# EAGLE design DyIO_Rev12_va (EAGLE 5.11)
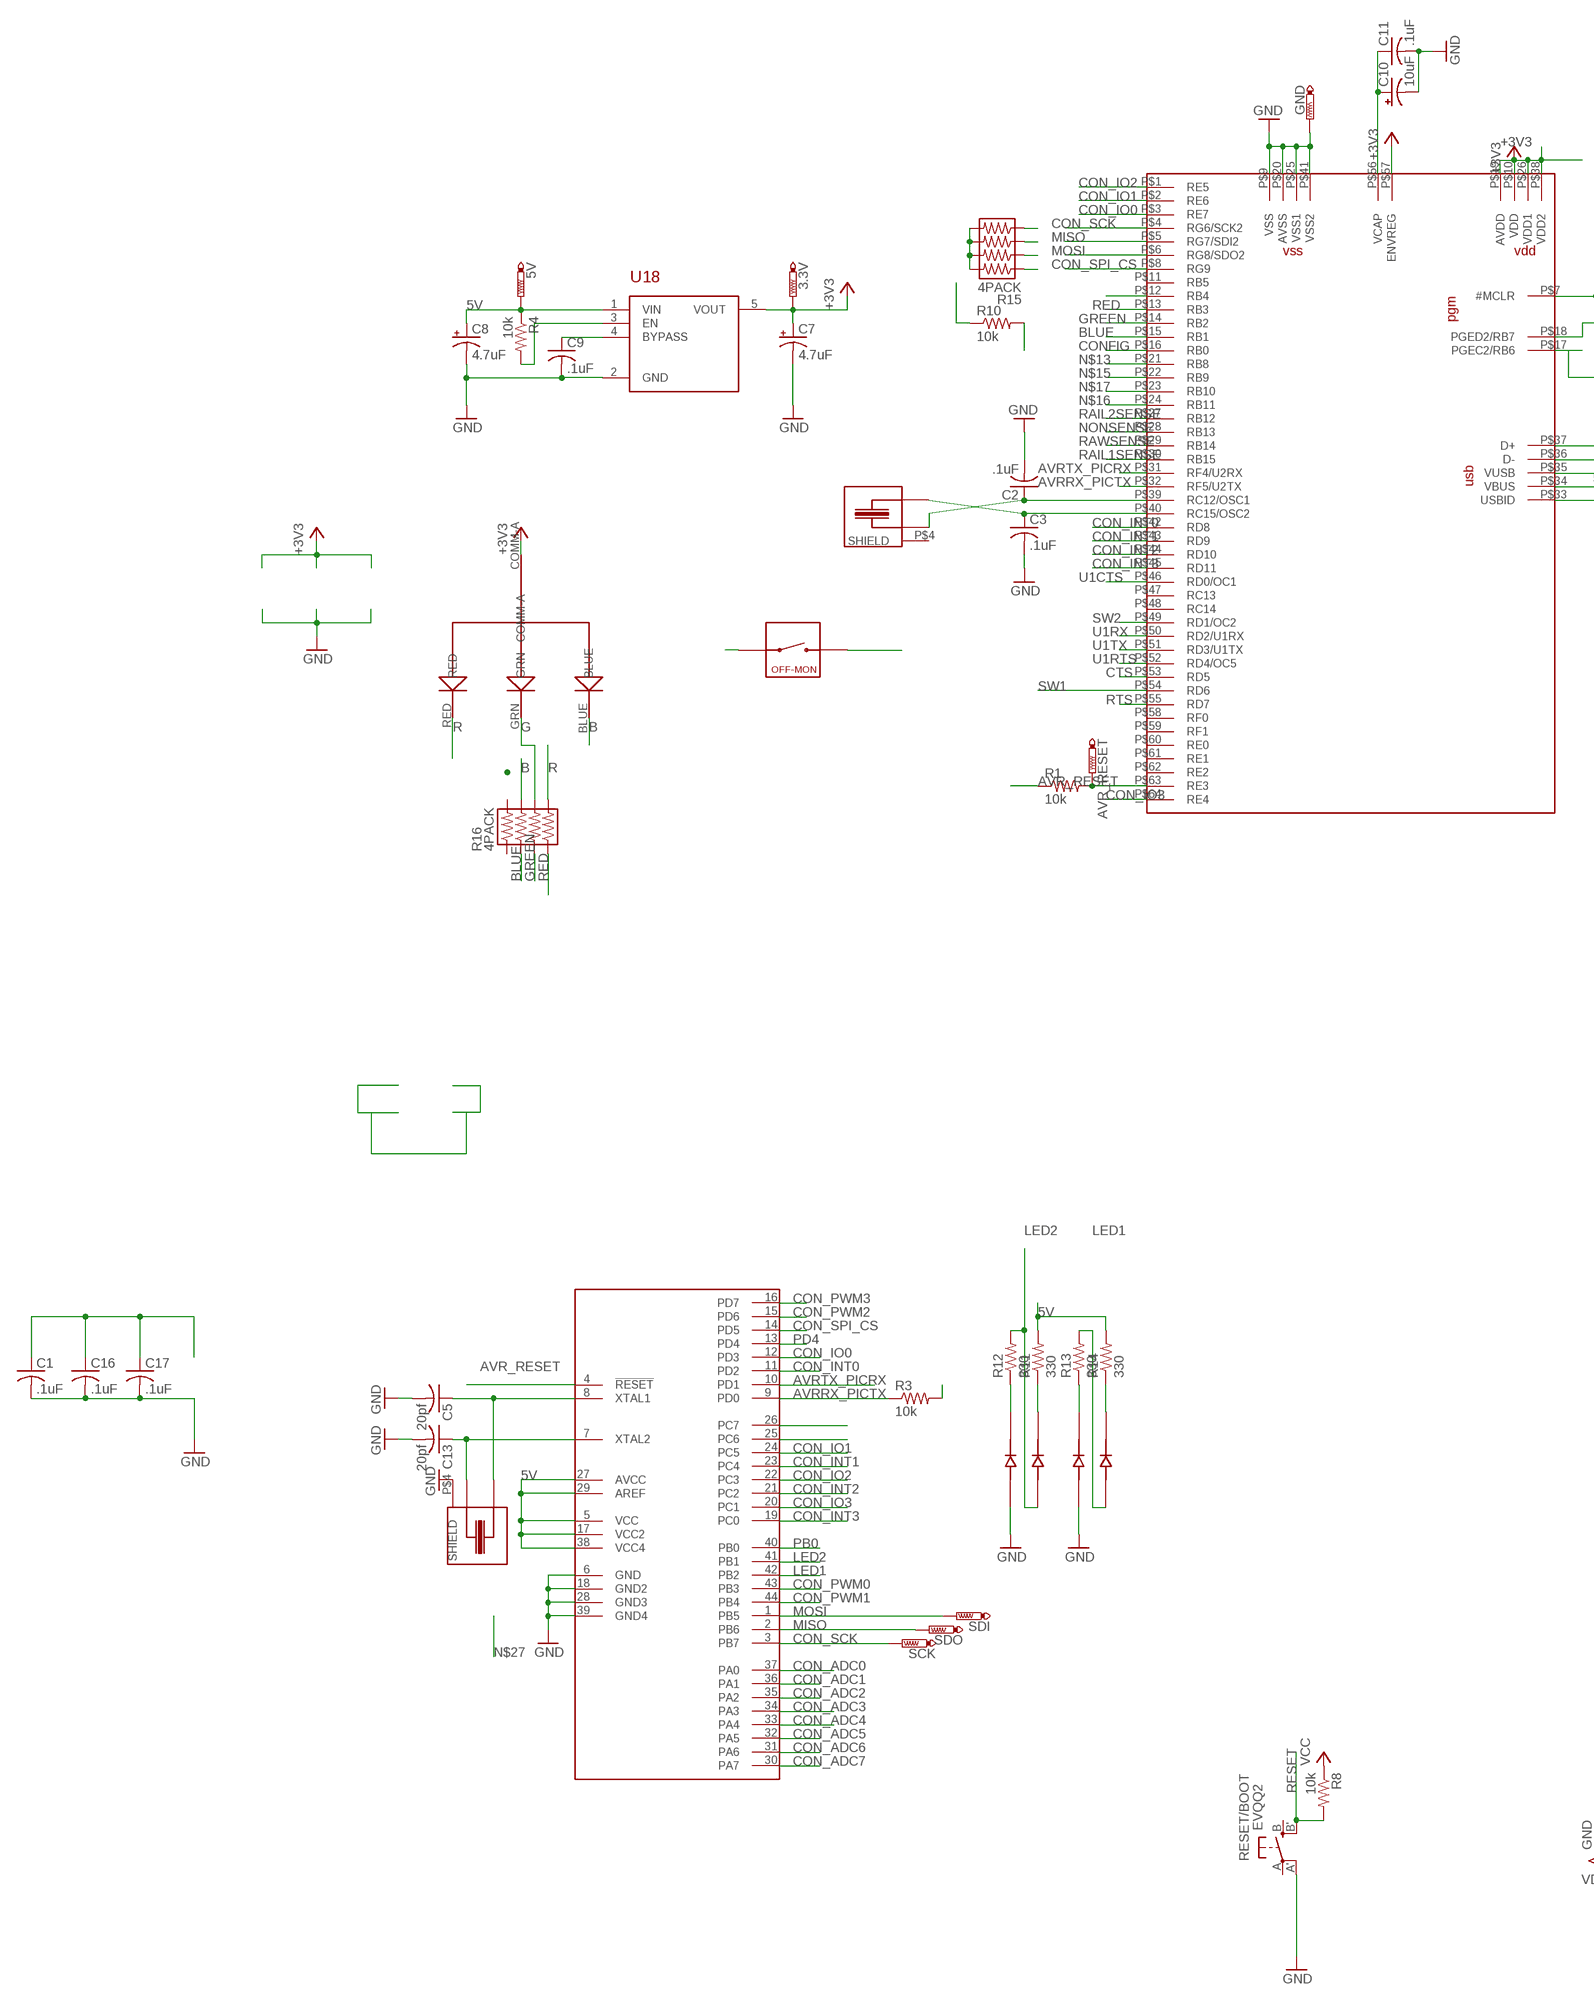
[diagram p0: schematic, sheet 1, part 1 of 2]
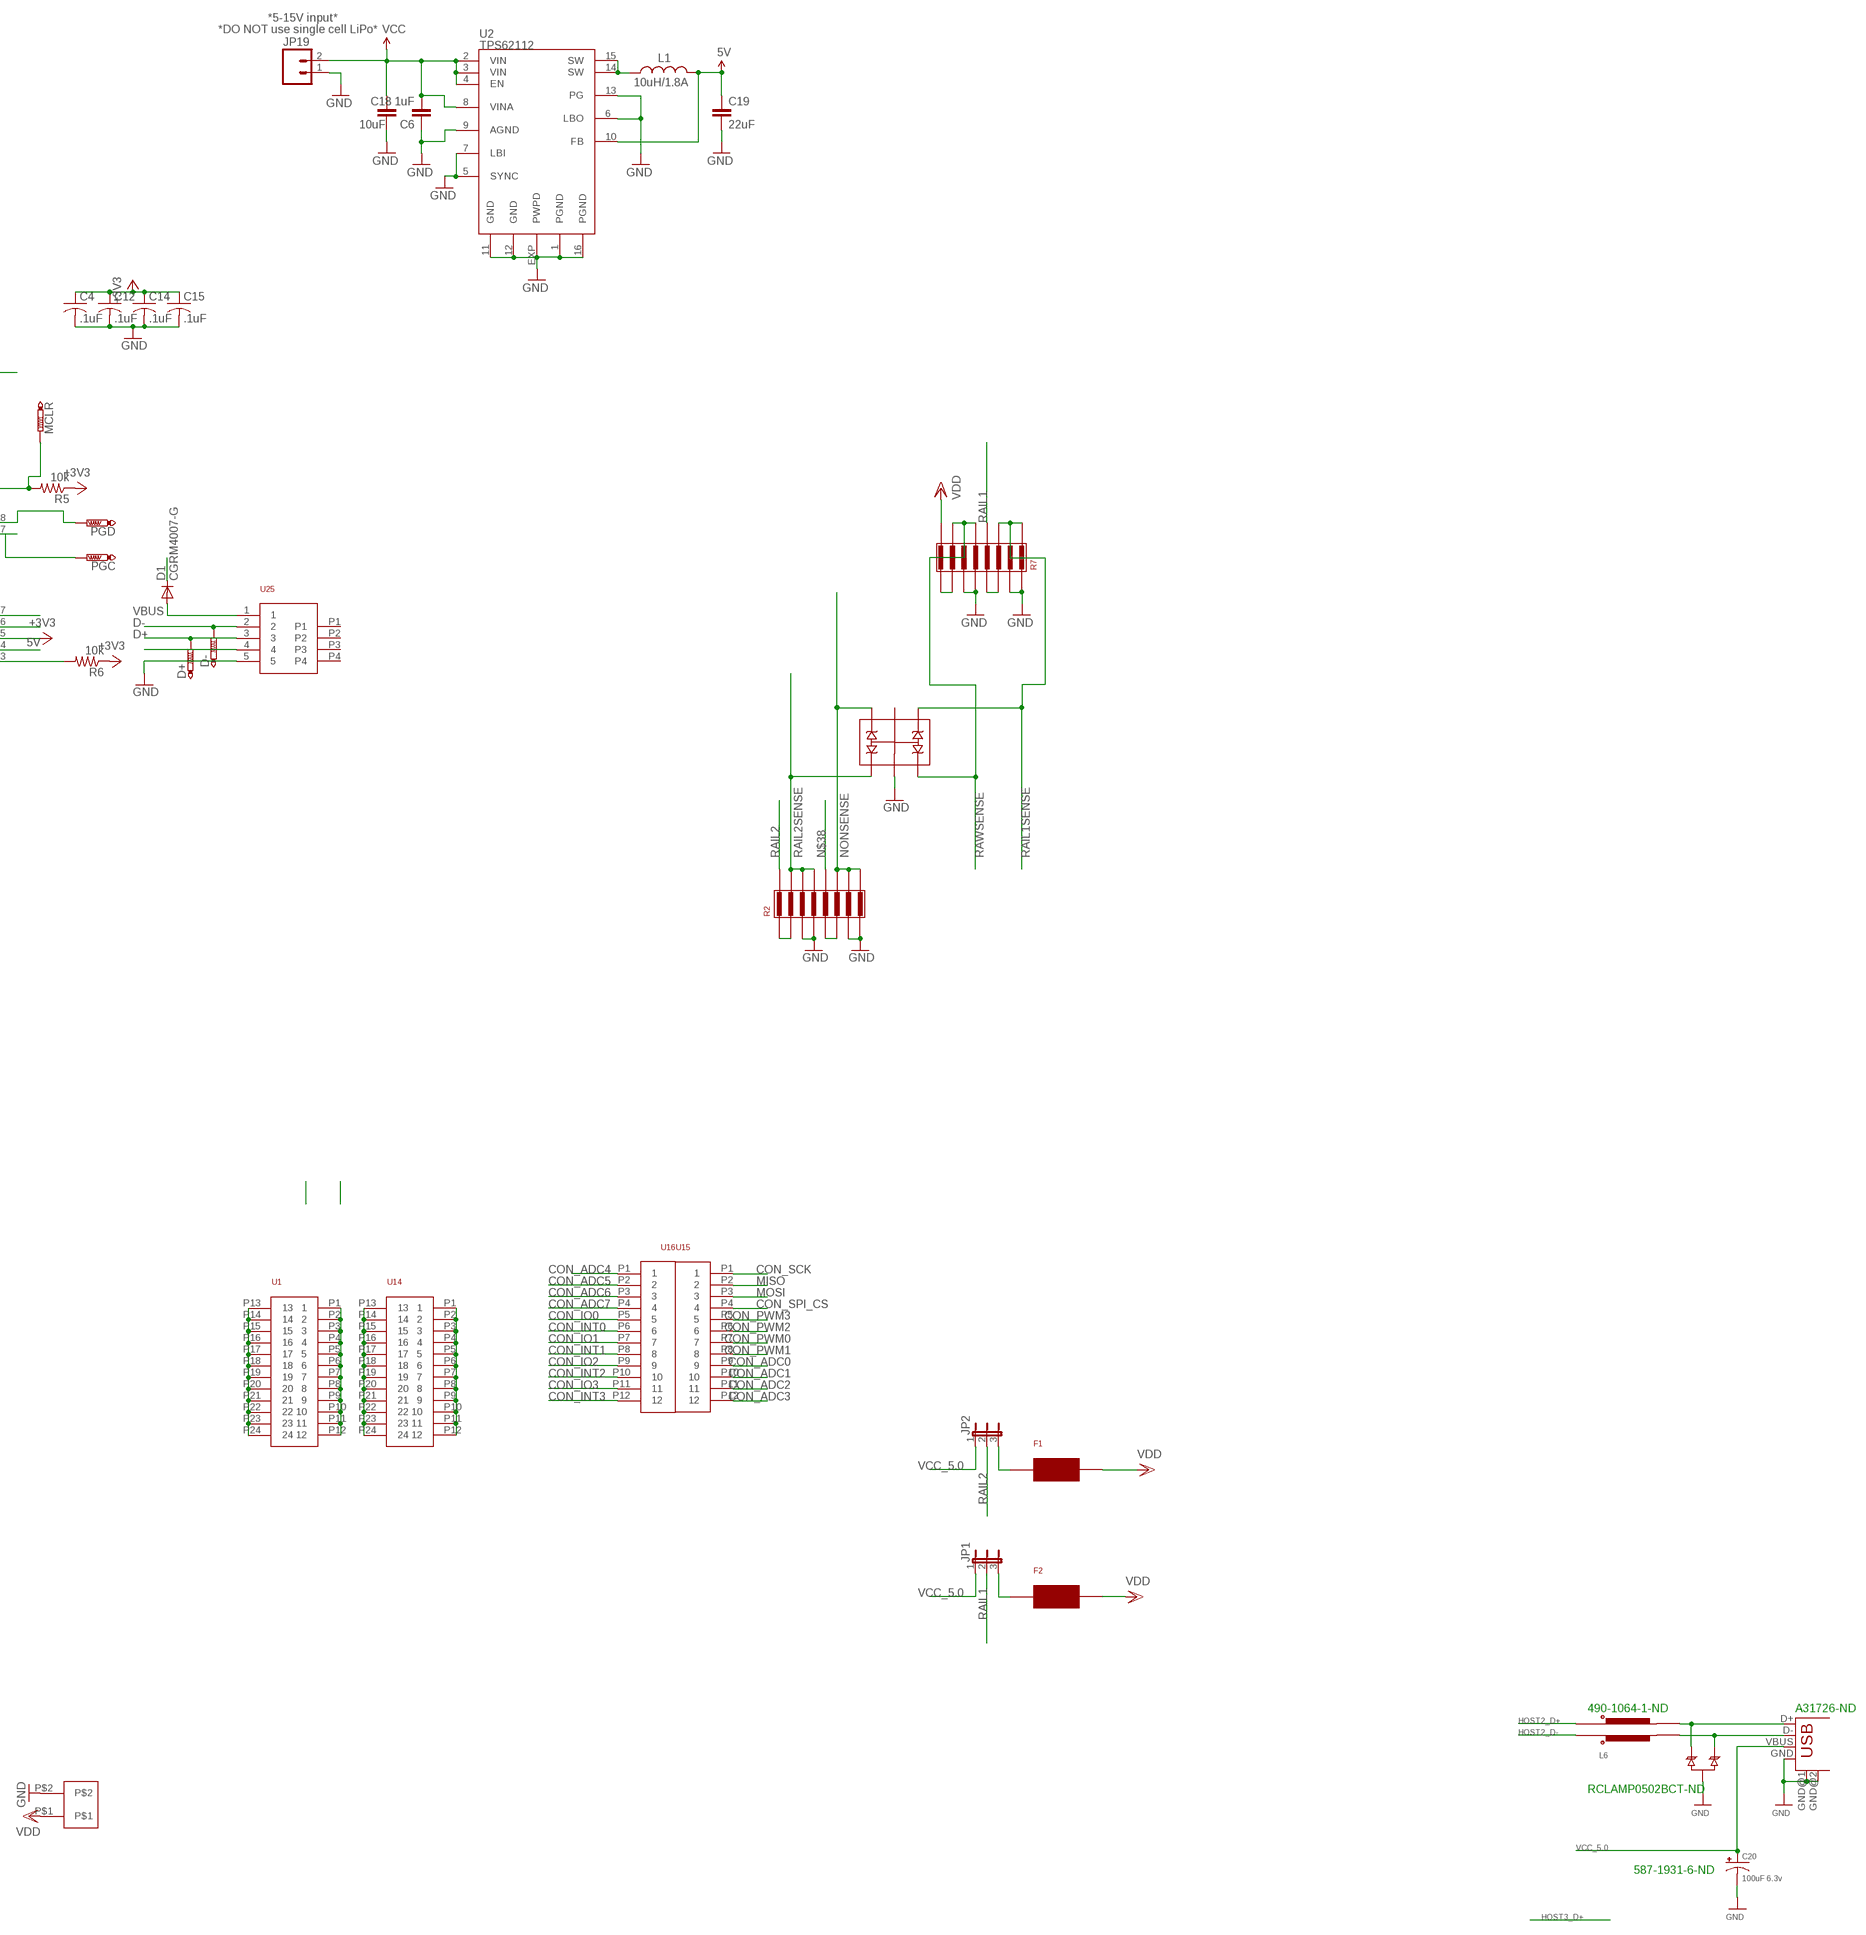
[diagram p1: schematic, sheet 1, part 2 of 2]

## Parts
3.3V  PTR1TP14R  [TP14R]
5V  PTR1TP14R  [TP14R]
AVR_RESET  PTR1TP14R  [TP14R]
C1  .1uF  C-USC0603  [C0603]
C2  .1uF  C-USC0603  [C0603]
C3  .1uF  C-USC0603  [C0603]
C4  .1uF  C-USC0603  [C0603]
C5  20pf  C-USC0603  [C0603]
C6  1uF  CAP0805  [0805]
C7  4.7uF  CPOL-USR/2012-12R  [R/2012-12R]
C8  4.7uF  CPOL-USR/2012-12R  [R/2012-12R]
C9  .1uF  C-USC0402  [C0402]
C10  10uF  CPOL-USR/2012-12R  [R/2012-12R]
C11  .1uF  C-USC0603  [C0603]
C12  .1uF  C-USC0603  [C0603]
C13  20pf  C-USC0603  [C0603]
C14  .1uF  C-USC0603  [C0603]
C15  .1uF  C-USC0603  [C0603]
C16  .1uF  C-USC0603  [C0603]
C17  .1uF  C-USC0603  [C0603]
C18  10uF  CAP1210  [1210]
C19  22uF  CAP1210  [1210]
C20  100uF 6.3v  CPOL-USE1.8-4  [E1,8-4]
D1  CGRM4007-G  [SOD-123_MINI-SMA]
D+  PTR1TP14R  [TP14R]
D-  PTR1TP14R  [TP14R]
F1  0154  [0154]
F2  0154  [0154]
GND  PTR1B1,27  [B1,27]
JP1  JP2E  [JP2]
JP2  JP2E  [JP2]
JP19  M02-JST-2MM-SMT  [JST-2-SMD]
L1  10uH/1.8A  INDUCTORSRU5028  [SRU5028]
L6  FERITE_S0805  [SPLIT_0805]
MCLR  PTR1TP14R  [TP14R]
PGC  PTR1TP14R  [TP14R]
PGD  PTR1TP14R  [TP14R]
R1  10k  R-US_R0603  [R0603]
R2  741X163  [741X163]
R3  10k  R-US_R0603  [R0603]
R4  10k  R-US_R0402  [R0402]
R5  10k  R-US_R0603  [R0603]
R6  10k  R-US_R0603  [R0603]
R7  741X163  [741X163]
R8  10k  R-US_M0805  [M0805]
R10  10k  R-US_R0603  [R0603]
R11  330  R-US_R0603  [R0603]
R12  330  R-US_R0603  [R0603]
R13  330  R-US_R0603  [R0603]
R14  330  R-US_R0603  [R0603]
R15  4PACK  [4PACK_0603]
R16  4PACK  [4PACK_0603]
RESET/BOOT  EVQQ2  [EVQ-Q2]
SCK  PTR1TP14R  [TP14R]
SDI  PTR1TP14R  [TP14R]
SDO  PTR1TP14R  [TP14R]
SW3  SPST  [B3U-1000P]
U1  2X12  [2X12]
U2  TPS62112  TPS6211  [QFN16-4X4]
U3  PIC32-64TQFP64-2  [TQFP64-2]
U6  RCLAMP0502B  [SOT-523]
U7  2CLED  [1.6X1.5]
U8  TRI-LED-SMD  [TRI_LED_SMD]
U13  2CLED  [1.6X1.5]
U14  2X12  [2X12]
U15  1X12  [1X12]
U16  1X12  [1X12]
U18  LDS3985XX33  [SOT23-5]
U25  1734035-1_USB  [1734035-1_1734035]
U$2  ATMEGA644QFP  [TQFP44]
U$19  2P  [2PTH]
U$20  UCLAMP3304A  [UCLAMP3304A]
USB2  USB-A-H  [USB-A-H]
X2  CMR3XXT  [CMR309T]
X4  CMR3XXT  [CMR309T]

## Nets
5V: 5V.TP C1.1 C8.+ C16.1 C17.1 C19.1 D1.C L1.2 R1.1 R3.2 R4.1 R11.2 R14.2 R15.R1A R15.R2A R15.R3A R15.R4A U2.10(FB) U3.P$34(VBUS) U18.1(VIN) U$2.5(VCC) U$2.17(VCC2) U$2.27(AVCC) U$2.29(AREF) U$2.38(VCC4)
32MCLR: MCLR.TP R5.2 U3.P$7(#MCLR)
32PGC: PGC.TP U3.P$17(PGEC2/RB6)
32PGD: PGD.TP U3.P$18(PGED2/RB7)
+3V3: 3.3V.TP C4.1 C7.+ C12.1 C14.1 C15.1 R5.1 R6.1 SW3.P$1 U3.P$10(VDD) U3.P$19(AVDD) U3.P$26(VDD1) U3.P$35(VUSB) U3.P$38(VDD2) U3.P$57(ENVREG) U8.COMM-A U18.5(VOUT)
AVR_RESET: AVR_RESET.TP R1.2 U3.P$63(RE3) U$2.4(!RESET)
AVRRX_PICTX: R3.1 U3.P$32(RF5/U2TX) U$2.9(PD0)
AVRTX_PICRX: U3.P$31(RF4/U2RX) U$2.10(PD1)
B: R16.R2A U8.BLUE
BLUE: R16.R2B U3.P$15(RB1)
CON_ADC0: U15.P9 U$2.37(PA0)
CON_ADC1: U15.P10 U$2.36(PA1)
CON_ADC2: U15.P11 U$2.35(PA2)
CON_ADC3: U15.P12 U$2.34(PA3)
CON_ADC4: U16.P1 U$2.33(PA4)
CON_ADC5: U16.P2 U$2.32(PA5)
CON_ADC6: U16.P3 U$2.31(PA6)
CON_ADC7: U16.P4 U$2.30(PA7)
CON_INT0: U3.P$42(RD8) U16.P6 U$2.11(PD2)
CON_INT1: U3.P$43(RD9) U16.P8 U$2.23(PC4)
CON_INT2: U3.P$44(RD10) U16.P10 U$2.21(PC2)
CON_INT3: U3.P$45(RD11) U16.P12 U$2.19(PC0)
CON_IO0: U3.P$3(RE7) U16.P5 U$2.12(PD3)
CON_IO1: U3.P$2(RE6) U16.P7 U$2.24(PC5)
CON_IO2: U3.P$1(RE5) U16.P9 U$2.22(PC3)
CON_IO3: U3.P$64(RE4) U16.P11 U$2.20(PC1)
CON_PWM0: U15.P7 U$2.43(PB3)
CON_PWM1: U15.P8 U$2.44(PB4)
CON_PWM2: U15.P6 U$2.15(PD6)
CON_PWM3: U15.P5 U$2.16(PD7)
CON_SCK: R15.R4B SCK.TP U3.P$4(RG6/SCK2) U15.P1 U$2.3(PB7)
CON_SPI_CS: R15.R1B U3.P$8(RG9) U15.P4 U$2.14(PD5)
CONFIG: R10.2 SW3.P$3 U3.P$16(RB0)
CTS: U3.P$53(RD5) U$2.26(PC7)
D+: D+.TP U3.P$37(D+) U25.3
D-: D-.TP U3.P$36(D-) U25.2
G: R16.R3A U8.GRN
GND: C1.2 C2.2 C3.2 C4.2 C5.2 C6.1 C7.- C8.- C9.2 C10.- C11.2 C12.2 C13.2 C14.2 C15.2 C16.2 C17.2 C18.2 C19.2 C20.- GND.PP(TP) JP19.1 R2.R3A R2.R4A R2.R7A R2.R8A R7.R1A R7.R2A R7.R5A R7.R6A R10.1 RESET/BOOT.A'(P1) U1.P13 U1.P14 U1.P15 U1.P16 U1.P17 U1.P18 U1.P19 U1.P20 U1.P21 U1.P22 U1.P23 U1.P24 U2.1(PGND) U2.5(SYNC) U2.6(LBO) U2.7(LBI) U2.9(AGND) U2.11(GND) U2.12(GND) U2.13(PG) U2.16(PGND) U2.EXP(PWPD) U3.P$9(VSS) U3.P$20(AVSS) U3.P$25(VSS1) U3.P$41(VSS2) U6.3 U7.1T U13.1T U14.P1 U14.P2 U14.P3 U14.P4 U14.P5 U14.P6 U14.P7 U14.P8 U14.P9 U14.P10 U14.P11 U14.P12 U18.2(GND) U25.5 U$2.6(GND) U$2.18(GND2) U$2.28(GND3) U$2.39(GND4) U$19.P$2 U$20.2 USB2.GND USB2.GND@1(GND) USB2.GND@2(GND) X4.P$4(SHIELD)
GREEN: R16.R3B U3.P$14(RB2)
HOST2_D+: L6.1
HOST2_D-: L6.4
LED1: R13.2 U13.2T U$2.42(PB2)
LED2: R12.2 U7.2T U$2.41(PB1)
MISO: R15.R3B SDO.TP U3.P$5(RG7/SDI2) U15.P2 U$2.2(PB6)
MOSI: R15.R2B SDI.TP U3.P$6(RG8/SDO2) U15.P3 U$2.1(PB5)
N$2: R4.2 U18.3(EN)
N$3: C9.1 U18.4(BYPASS)
N$4: C3.1 U3.P$40(RC15/OSC2) X2.P$1
N$5: C10.+ C11.1 U3.P$56(VCAP)
N$6: C2.1 U3.P$39(RC12/OSC1) X2.P$3
N$8: C5.1 U$2.8(XTAL1) X4.P$1
N$9: C13.1 U$2.7(XTAL2) X4.P$3
N$10: L6.2 U6.2 USB2.D+
N$12: R7.R7A R7.R8A
N$13: U3.P$21(RB8)
N$14: R12.1 U7.1A
N$15: U3.P$22(RB9)
N$16: U3.P$24(RB11)
N$17: U3.P$23(RB10)
N$19: L6.3 U6.1 USB2.D-
N$20: F1.1 JP2.3
N$21: F2.1 JP1.3
N$23: U3.P$12(RB4)
N$25: R13.1 U13.1A
N$26: R11.1 U7.2A
N$30: R14.1 U13.2A
N$33: R2.R5A R2.R6A
N$35: R7.R3A R7.R4A
N$36: R2.R1A R2.R2A
N$38: R2.R5B
NONSENSE: R2.R6B R2.R7B R2.R8B U3.P$28(RB13) U$20.6
PB0: U$2.40(PB0)
PD4: U$2.13(PD4)
R: R16.R4A U8.RED
RAIL1: R7.R4B U14.P13 U14.P14 U14.P15 U14.P16 U14.P17 U14.P18 U14.P19 U14.P20 U14.P21 U14.P22 U14.P23 U14.P24
RAIL1SENSE: R7.R1B R7.R2B R7.R3B U3.P$30(RB15) U$20.4
RAIL2: JP2.2 R2.R1B U1.P1 U1.P2 U1.P3 U1.P4 U1.P5 U1.P6 U1.P7 U1.P8 U1.P9 U1.P10 U1.P11 U1.P12
RAIL2SENSE: R2.R2B R2.R3B R2.R4B U3.P$27(RB12) U$20.1
RAWSENSE: R7.R5B R7.R6B R7.R7B U3.P$29(RB14) U$20.3
RED: R16.R4B U3.P$13(RB3)
RESET: R8.2 RESET/BOOT.B'(S1)
RTS: U3.P$55(RD7) U$2.25(PC6)
SW: L1.1 U2.14(SW) U2.15(SW)
SW1: U3.P$54(RD6)
SW2: U3.P$49(RD1/OC2)
U1CTS: U3.P$46(RD0/OC1)
U1RTS: U3.P$52(RD4/OC5)
U1RX: U3.P$50(RD2/U1RX)
U1TX: U3.P$51(RD3/U1TX)
USBID: R6.2 U3.P$33(USBID) U25.4
VBUS: D1.A U25.1
VCC: C6.2 C18.1 JP19.2 R8.1 U2.2(VIN) U2.3(VIN) U2.4(EN) U2.8(VINA)
VCC_5.0: C20.+ JP1.1 JP2.1 USB2.VBUS
VDD: F1.2 F2.2 R7.R8B U$19.P$1
Unconnected: JP1.2 R16.R1A R16.R1B RESET/BOOT.A(P) RESET/BOOT.B(S) U3.P$11(RB5) U3.P$47(RC13) U3.P$48(RC14) U3.P$58(RF0) U3.P$59(RF1) U3.P$60(RE0) U3.P$61(RE1) U3.P$62(RE2) U25.P1 U25.P2 U25.P3 U25.P4 U$20.5 X2.P$4(SHIELD)

## Notes on the sheet
- *5-15V input*
- *DO NOT use single cell LiPo*
- 490-1064-1-ND | A31726-ND
- RCLAMP0502BCT-ND
- 587-1931-6-ND

## Library data of the parts
3.3V 5V AVR_RESET D+ D- GND MCLR PGC PGD SCK SDI SDO = testpad:PTR1: TEST PIN
C1-C5 C9 C11-C17 = rcl:C-US: CAPACITOR, American symbol
C6 C18 C19 = SparkFun:CAP: Capacitor Standard 0603 ceramic capacitor, and 0.1" leaded capacitor.
C7 C8 C10 C20 = rcl:CPOL-US: POLARIZED CAPACITOR, American symbol
D1 = diode:CGRM400*-G: Molded plasitc,JEDEC SOD-123/Mini SMA Source: Comchip CGRM4001-G.pdf
F1 F2 = SMT_Fuse_0154001:0154
JP1 JP2 = jumper:JP2E: JUMPER
JP19 = SparkFun:M02: Header 2 Standard 2-pin 0.1" header. Use with straight break away headers (SKU : PRT-00116), right angle break away headers (PRT-00553), swiss pins (PRT-00743), machine pins (PRT-00117), and female headers (PRT-00115). Molex polarized connector foot print use with SKU : PRT-08233 with associated crimp pins and housings.
L1 = SparkFun:INDUCTOR: Inductors Basic Inductor/Choke - 0603 and 1206. Footprints are not proven and vary greatly between part numbers.
L6 = ferrite_split_0805:FERITE_S0805
R1 R3-R6 R10-R14 = rcl:R-US_: RESISTOR, American symbol
R2 R7 = 741X163:741X163
R8 = adafruit:R-US_: RESISTOR, American symbol
R15 R16 = ResistorBlocks:4PACK: This is a 0603x4 resistor block. Digikey PN:MNR14103RCT-ND
RESET/BOOT = adafruit:EVQQ2: SMT 6mm switch, EVQQ2 series http://www.ladyada.net/library/eagle
SW3 = B3U-1000P:SPST
U1 U14 = 1x12_header:2X12
U2 = SparkFun:TPS6211*: TPS62112: 1.5A Step-Down Converter
U3 = pic32:PIC32-64
U6 = rclamp0502b:RCLAMP0502B
U7 U13 = 2cled:2CLED: 160-1452-1-ND
U8 = TRI_LED_SMD:TRI-LED-SMD: Common Annode smd tri-color RGB led.
U15 U16 = 1x12_header:1X12
U18 = LDS3985XX33:LDS3985XX33
U25 = YESIN_USB:1734035-1_USB
U$2 = atmega644:ATMEGA644
U$19 = con_2h_70555-0001:2P
U$20 = UCLAMP3304A:UCLAMP3304A
USB2 = con-usb-2:USB: USB Connectors
X2 X4 = cmr3XXT:CMR3XXT

## Board
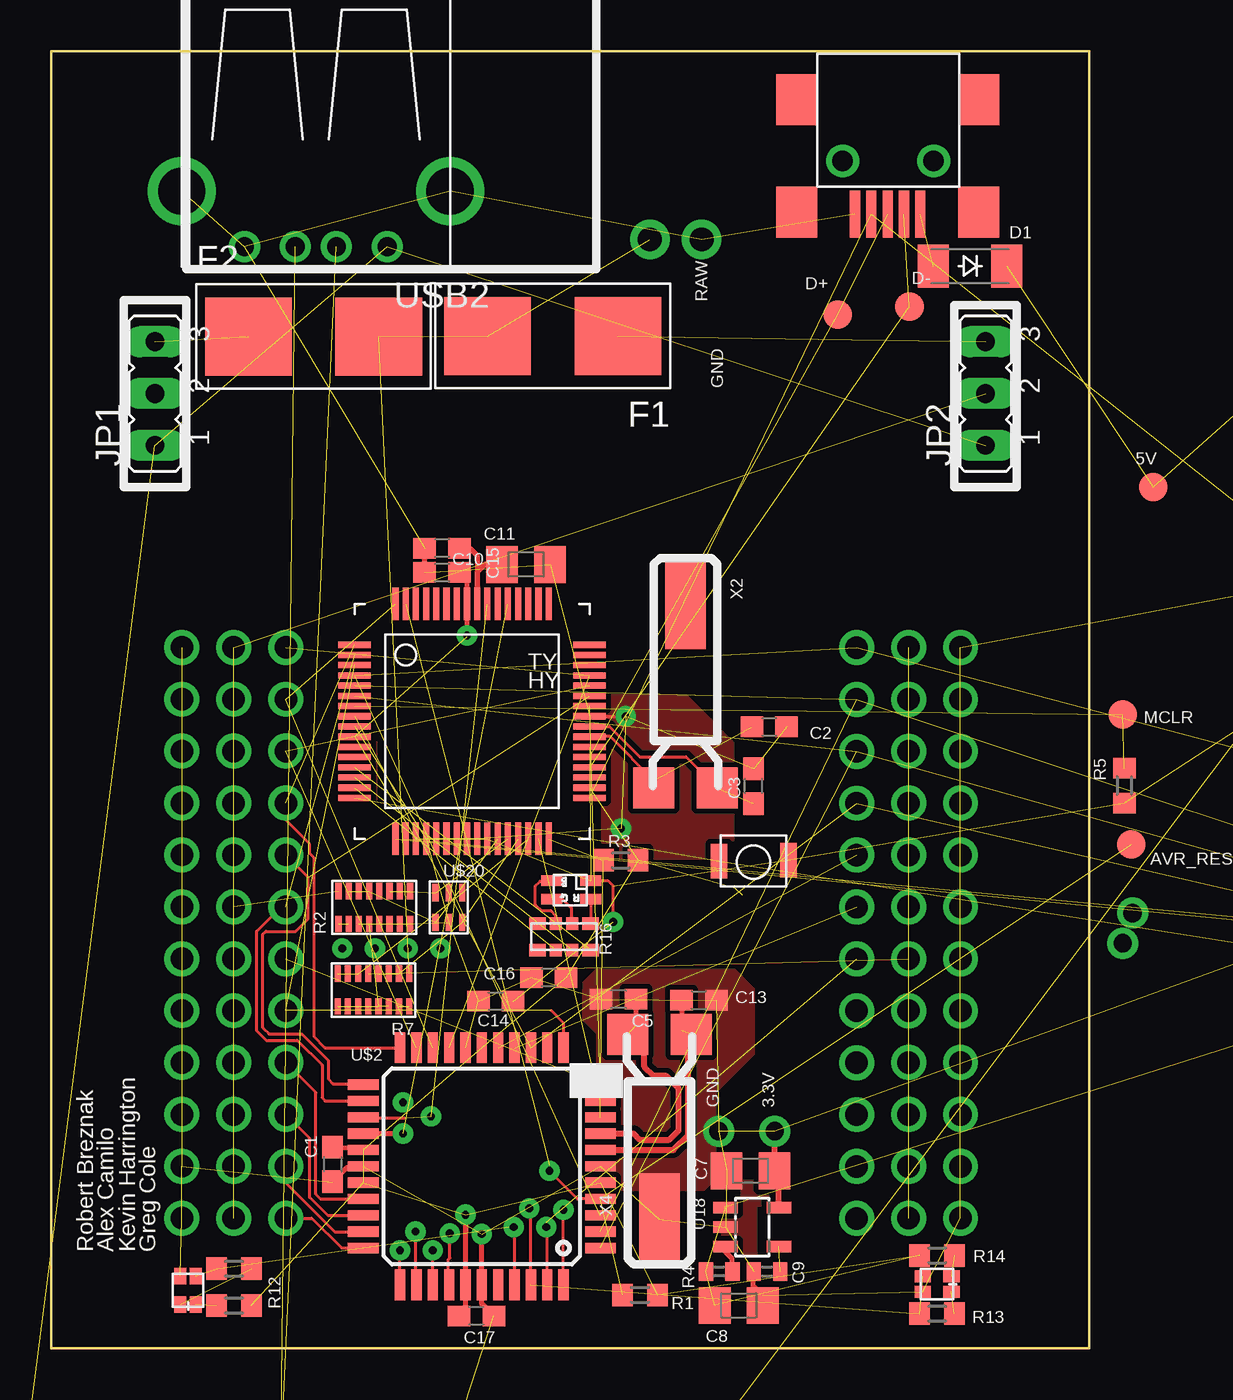
[diagram p2: board, top side]
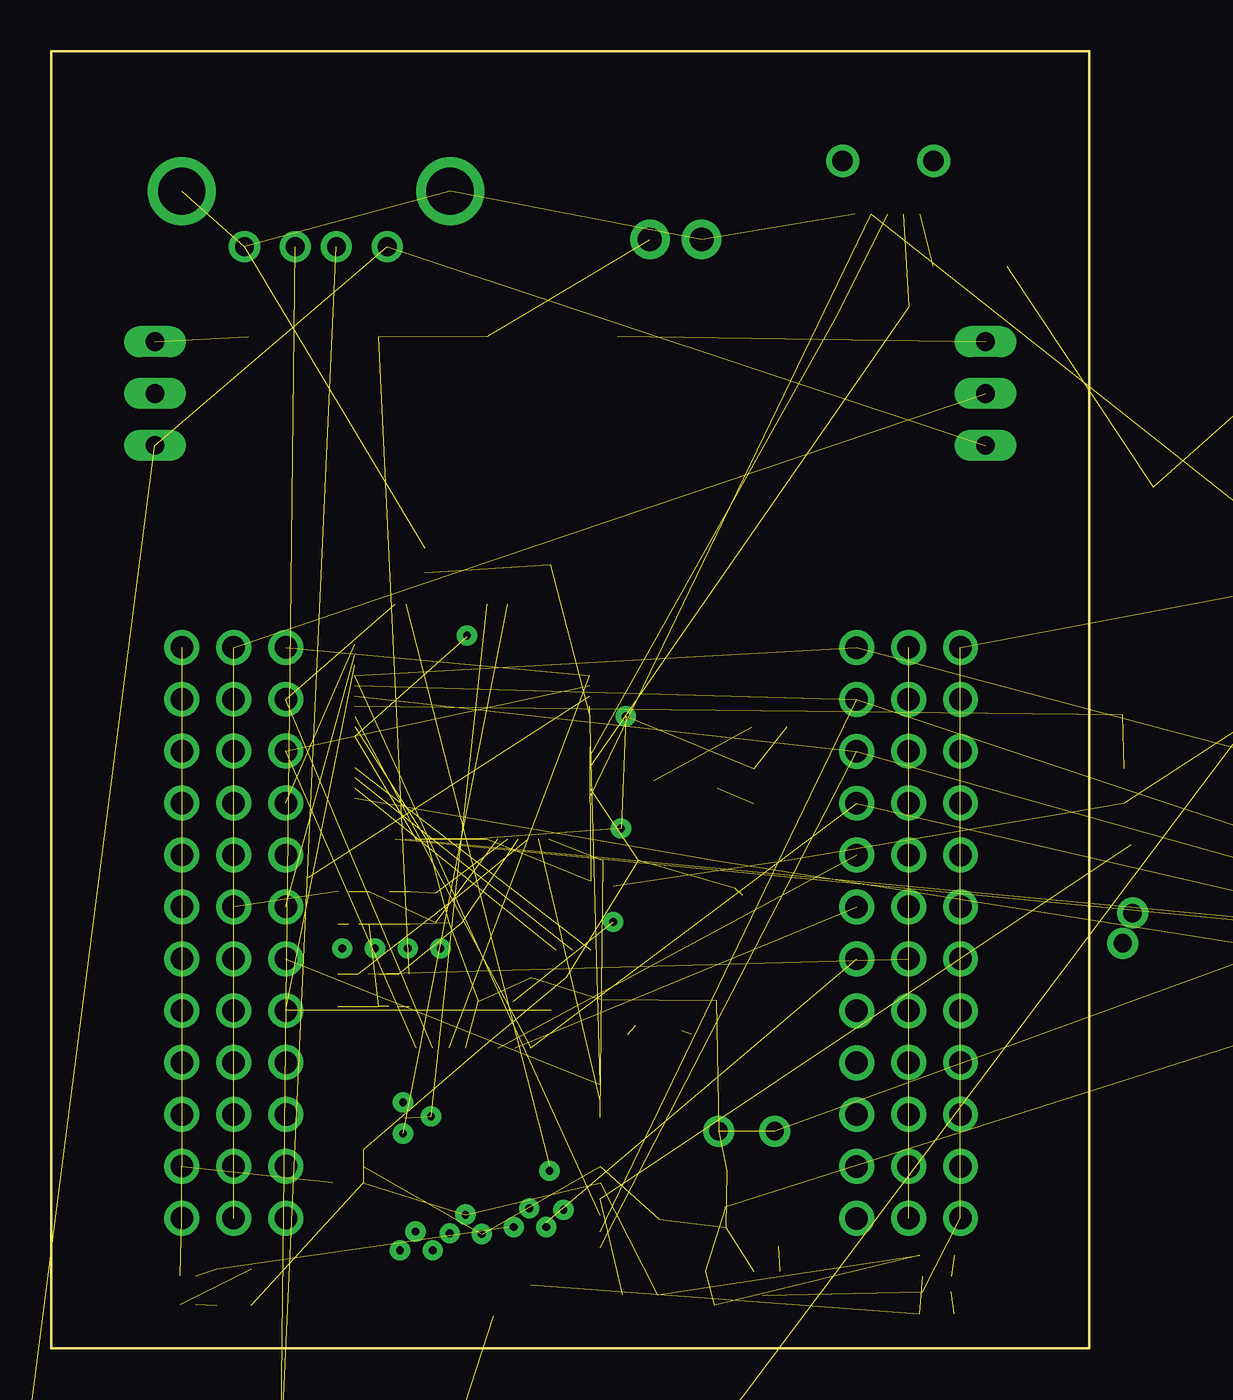
[diagram p3: board, inner layer Route2]
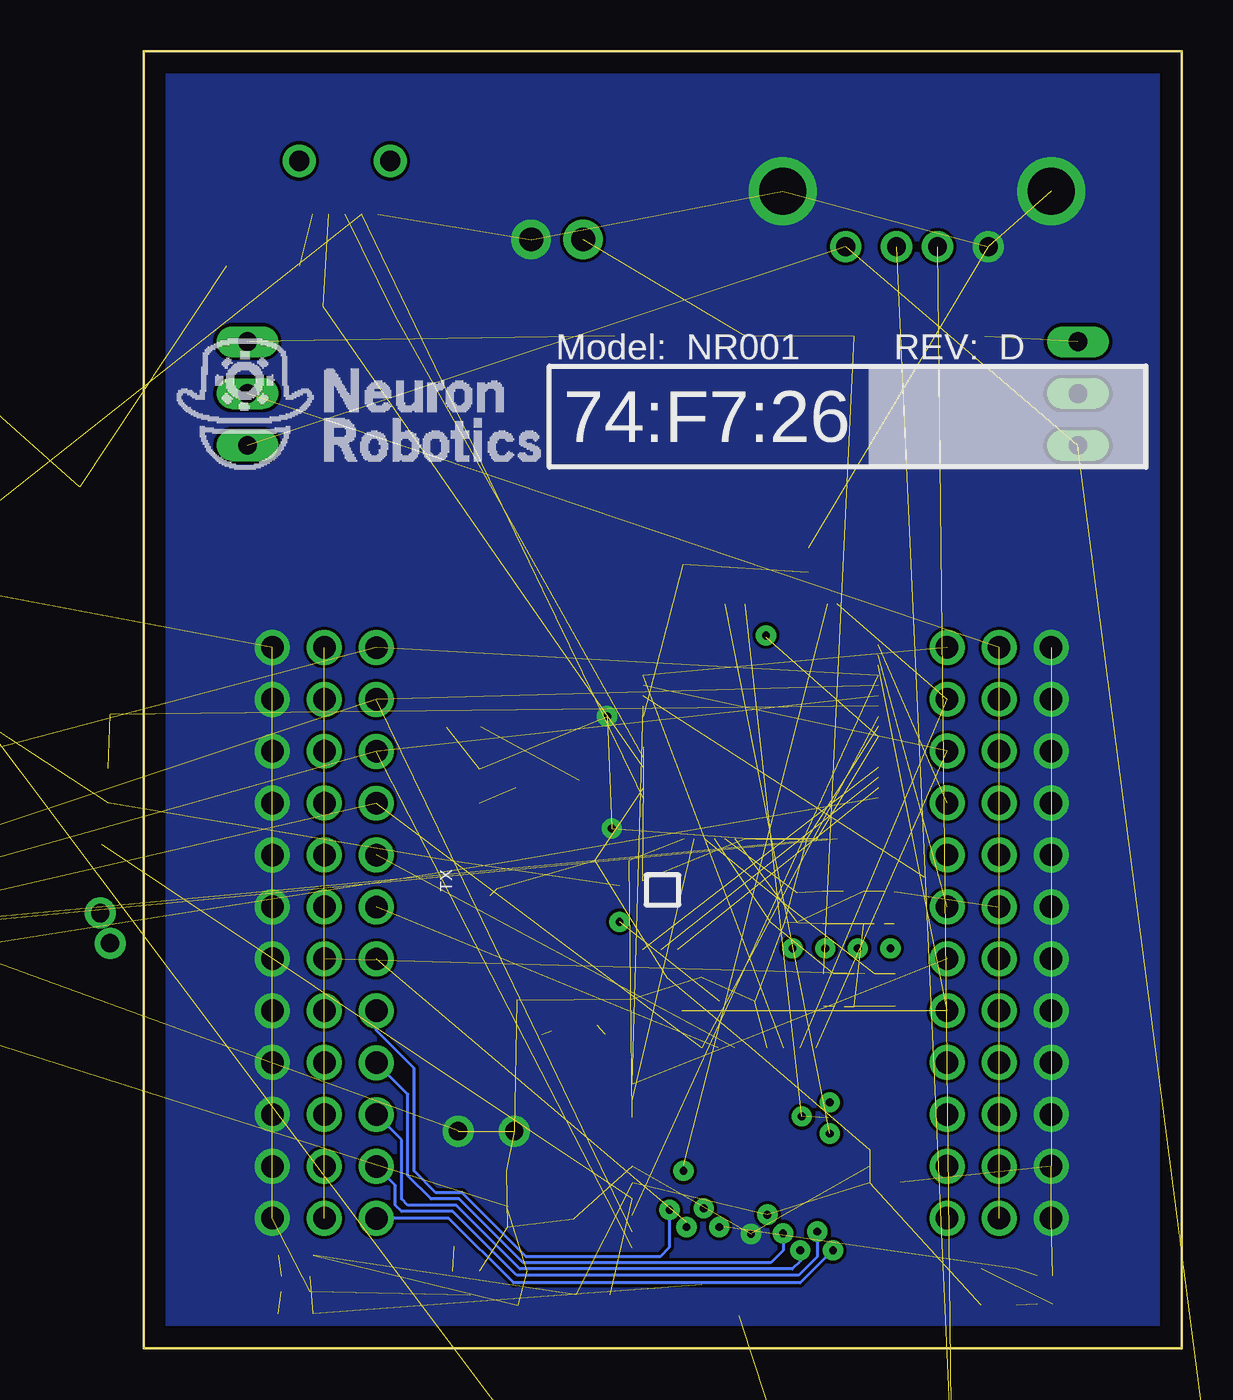
[diagram p4: board, bottom side, seen from below]

Size 50.8 x 63.5 mm. Coordinates in mm from the lower left corner, seen from the top.
Copper layers (1*2+3*16): Top 0.035mm / dielectric 1.5mm / Route2 0.035mm / dielectric 0.15mm / Route3 0.035mm / dielectric 0.2mm / Bottom 0.035mm
Design rules "default *": minimum track width 6mil, minimum drill 15mil, track to track 6mil, track to pad 6mil, pad to pad 6mil, via to via 6mil, smd to smd 6mil, copper to edge 40mil, drill to drill 6mil, minimum pad ring 12mil, minimum via ring 12mil, stop-mask expansion 4mil, vias tented up to drill 20mil, thermal gap 0mil

### Footprints (pad centres in the part's own frame; a part is rotated, then mirrored left to right if it is on the bottom)
TP14R = smd 1.4 x 1.4: TP 0,0
C0603 = smd 1.1 x 1: 1 -0.85,0; 2 0.85,0
0805 = smd 0.8 x 1.2: 1 -0.9,0; 2 0.9,0
R/2012-12R = smd 1.55 x 1.8: + 1.175,0; - -1.175,0
C0402 = smd 0.7 x 0.9: 1 -0.65,0; 2 0.65,0
1210 = smd 1.2 x 2: 1 -1.6,0; 2 1.6,0
E1,8-4 = drill 0.711 pad 1.168 round: + -0.889,0 | drill 0.711 pad 1.168 octagon: - 0.889,0
SOD-123_MINI-SMA = smd 1.5 x 2.1: A 1.8,0; C -1.8,0
0154 = smd 4.24 x 3.81: 1 0,0; 2 6.38,0
B1,27 = smd 1.27 x 1.27: PP 0,0
JP2 = drill 0.914 long: 1 -2.54,0; 2 0,0; 3 2.54,0
JST-2-SMD = smd 1 x 4.6: 1 -1,-3.7; 2 1,-3.7 | smd 1.6 x 3.4: NC1 -3.4,1.5; NC2 3.4,1.5
SRU5028 = smd 1.1 x 2: 1 2.4,0; 2 -2.4,0 | smd 2 x 1.1: P$1 0,2.4; P$2 0,-2.4
SPLIT_0805 = smd 0.45 x 0.4: 1 0.225,-0.2; 2 1.775,-0.2; 3 1.775,-1; 4 0.225,-1
R0603 = smd 1 x 1.1: 1 -0.85,0; 2 0.85,0
741X163 = smd 0.3 x 0.8: R1A 0,0.4; R1B 0,2; R2A 0.5,0.4; R2B 0.5,2; R3A 1,0.4; R3B 1,2; R4A 1.5,0.4; R4B 1.5,2; R5A 2,0.4; R5B 2,2; R6A 2.5,0.4; R6B 2.5,2; R7A 3,0.4; R7B 3,2; R8A 3.5,0.4; R8B 3.5,2
R0402 = smd 0.7 x 0.9: 1 -0.65,0; 2 0.65,0
M0805 = smd 1.3 x 1.6: 1 -0.95,0; 2 0.95,0
4PACK_0603 = smd 0.8 x 0.6: R1A -2.78,-0.6; R1B -2.78,-1.9; R4A -0.18,-0.6; R4B -0.18,-1.9 | smd 0.6 x 0.6: R2A -1.88,-0.6; R2B -1.88,-1.9; R3A -1.08,-0.6; R3B -1.08,-1.9
EVQ-Q2 = smd 3.2 x 1.2: A -3.4,-2; A' 3.4,-2; B -3.4,2; B' 3.4,2
B3U-1000P = smd 0.8 x 1.7: P$1 0.4,-0.1; P$3 3.8,-0.05
2X12 = drill 1.1 round: P1 -0.635,0.635; P2 1.905,0.635; P3 4.445,0.635; P4 6.985,0.635; P5 9.525,0.635; P6 12.065,0.635; P7 14.605,0.635; P8 17.145,0.635; P9 19.685,0.635; P10 22.225,0.635; P11 24.765,0.635; P12 27.305,0.635; P13 -0.635,-1.905; P14 1.905,-1.905; P15 4.445,-1.905; P16 6.985,-1.905; P17 9.525,-1.905; P18 12.065,-1.905; P19 14.605,-1.905; P20 17.145,-1.905; P21 19.685,-1.905; P22 22.225,-1.905; P23 24.765,-1.905; P24 27.305,-1.905
QFN16-4X4 = smd 0.8 x 0.35: 1 -2,0.975; 2 -2,0.325; 3 -2,-0.325; 4 -2,-0.975; 9 2,-0.975; 10 2,-0.325; 11 2,0.325; 12 2,0.975 | smd 0.35 x 0.8: 5 -0.975,-2; 6 -0.325,-2; 7 0.325,-2; 8 0.975,-2; 13 0.975,2; 14 0.325,2; 15 -0.325,2; 16 -0.975,2 | smd 2.5 x 2.5: EXP 0,0
TQFP64-2 = smd 1.6 x 0.3: P$1 0,-2; P$2 0,-2.5; P$3 0,-3; P$4 0,-3.5; P$5 0,-4; P$6 0,-4.5; P$7 0,-5; P$8 0,-5.5; P$9 0,-6; P$10 0,-6.5; P$11 0,-7; P$12 0,-7.5; P$13 0,-8; P$14 0,-8.5; P$15 0,-9; P$16 0,-9.5; P$33 11.5,-9.5; P$34 11.5,-9; P$35 11.5,-8.5; P$36 11.5,-8; P$37 11.5,-7.5; P$38 11.5,-7; P$39 11.5,-6.5; P$40 11.5,-6; P$41 11.5,-5.5; P$42 11.5,-5; P$43 11.5,-4.5; P$44 11.5,-4; P$45 11.5,-3.5; P$46 11.5,-3; P$47 11.5,-2.5; P$48 11.5,-2 | smd 0.3 x 1.6: P$17 2,-11.5; P$18 2.5,-11.5; P$19 3,-11.5; P$20 3.5,-11.5; P$21 4,-11.5; P$22 4.5,-11.5; P$23 5,-11.5; P$24 5.5,-11.5; P$25 6,-11.5; P$26 6.5,-11.5; P$27 7,-11.5; P$28 7.5,-11.5; P$29 8,-11.5; P$30 8.5,-11.5; P$31 9,-11.5; P$32 9.5,-11.5; P$49 9.5,0; P$50 9,0; P$51 8.5,0; P$52 8,0; P$53 7.5,0; P$54 7,0; P$55 6.5,0; P$56 6,0; P$57 5.5,0; P$58 5,0; P$59 4.5,0; P$60 4,0; P$61 3.5,0; P$62 3,0; P$63 2.5,0; P$64 2,0
SOT-523 = smd 0.4 x 0.8: 1 0,0; 2 1,0; 3 0.5,1.4
1.6X1.5 = smd 0.6 x 0.8: 1A 0.37,0.1; 1T 0.37,1.5; 2A 1.13,0.1; 2T 1.13,1.5
TRI_LED_SMD = smd 1.016 x 0.508: BLUE 1.7,-1.2; COMM-A -0.2,-1.2; GRN 1.7,-0.3; RED -0.2,-0.3
1X12 = drill 1.1 round: P1 -10.795,3.175; P2 -8.255,3.175; P3 -5.715,3.175; P4 -3.175,3.175; P5 -0.635,3.175; P6 1.905,3.175; P7 4.445,3.175; P8 6.985,3.175; P9 9.525,3.175; P10 12.065,3.175; P11 14.605,3.175; P12 17.145,3.175
SOT23-5 = smd 0.55 x 1.2: 1 -0.95,-1.3; 2 0,-1.3; 3 0.95,-1.3; 4 0.95,1.3; 5 -0.95,1.3
1734035-1_1734035 = smd 2.3 x 0.5: 1 -1.15,1.6; 2 -1.15,0.8; 3 -1.15,0; 4 -1.15,-0.8; 5 -1.15,-1.6 | smd 2.5 x 2: P1 -6.75,4.45; P2 -1.25,4.45; P3 -1.25,-4.45; P4 -6.75,-4.45 | drill 1 pad 1.3 round: P$1 -3.75,-2.2; P$2 -3.75,2.25
TQFP44 = smd 1.5 x 0.5: 1 -5.8,4; 2 -5.8,3.2; 3 -5.8,2.4; 4 -5.8,1.6; 5 -5.8,0.8; 6 -5.8,0; 7 -5.8,-0.8; 8 -5.8,-1.6; 9 -5.8,-2.4; 10 -5.8,-3.2; 11 -5.8,-4; 23 5.8,-4; 24 5.8,-3.2; 25 5.8,-2.4; 26 5.8,-1.6; 27 5.8,-0.8; 28 5.8,0; 29 5.8,0.8; 30 5.8,1.6; 31 5.8,2.4; 32 5.8,3.2; 33 5.8,4 | smd 0.5 x 1.5: 12 -4,-5.8; 13 -3.2,-5.8; 14 -2.4,-5.8; 15 -1.6,-5.8; 16 -0.8,-5.8; 17 0,-5.8; 18 0.8,-5.8; 19 1.6,-5.8; 20 2.4,-5.8; 21 3.2,-5.8; 22 4,-5.8; 34 4,5.8; 35 3.2,5.8; 36 2.4,5.8; 37 1.6,5.8; 38 0.8,5.8; 39 0,5.8; 40 -0.8,5.8; 41 -1.6,5.8; 42 -2.4,5.8; 43 -3.2,5.8; 44 -4,5.8
2PTH = drill 1.168 pad 1.93 round: P$1 -2.54,0; P$2 0,0
UCLAMP3304A = smd 0.3 x 0.85: 1 0,-1.025; 2 0.65,-1.025; 3 1.3,-1.025; 4 1.3,0.425; 5 0.65,0.425; 6 0,0.425
USB-A-H = drill 0.914 round: D+ 2.718,-1.003; D- 2.718,1.003; GND 2.718,-3.493; VBUS 2.718,3.493 | drill 2.311 round: GND@1 0,6.566; GND@2 0,-6.566
CMR309T = smd 2 x 2: P$1 1,1.7; P$3 1,-1.4 | smd 4.5 x 2: P$4 -8.05,0.15

### Placement (x,y rotation side)
3.3V  35.4,10.64 90 top
5V  53.92,42.16 0 top  (outside the outline)
AVR_RESET  52.84,24.66 0 top
C1  13.77,9.01 270 top
C2  35.14,30.42 0 top
C3  34.38,27.52 90 top
C4  69.54,26.96 270 top  (outside the outline)
C5  27.76,17.09 180 top
C6  65.38,38.4 180 top  (outside the outline)
C7  34.22,8.69 0 top
C8  33.65,2.1 180 top
C9  35.03,3.77 180 top
C10  23.24,38.37 180 top
C11  19.13,39.17 180 top
C12  69.55,23.93 90 top  (outside the outline)
C13  31.7,17.04 0 top
C14  21.75,16.99 180 top
C15  19.13,37.98 180 top
C16  24.36,18.15 180 top
C17  20.81,1.59 0 top
C18  65.46,40.92 0 top  (outside the outline)
C19  72.54,52.5 270 top  (outside the outline)
C20  -4.06,-33.78 0 top  (outside the outline)
D1  44.96,52.98 180 top
D+  38.5,50.6 0 top
D-  42,51 0 top
F1  27.74,49.56 180 top
F2  9.65,49.53 0 top
GND  32.65,10.63 90 top
JP1  5.08,46.74 90 top
JP2  45.72,46.74 90 top
JP19  -1.6,-44.5 0 top  (outside the outline)
L1  67.82,52.12 270 top  (outside the outline)
L6  -4.83,-38.1 0 top  (outside the outline)
MCLR  52.44,31.02 0 top
PGC  67.96,20.01 90 top  (outside the outline)
PGD  69.81,20.01 90 top  (outside the outline)
R1  28.81,2.62 180 top
R2  14.06,20.38 0 top
R3  27.87,23.89 0 top
R4  32.69,3.77 0 top
R5  52.52,27.55 90 top
R6  65.62,34.69 0 top  (outside the outline)
R7  14.02,16.34 0 top
R8  -4.04,-65.53 0 top  (outside the outline)
R10  68.19,18.39 180 top  (outside the outline)
R11  8.95,2.1 0 top
R12  8.95,3.9 180 top
R13  43.35,1.7 180 top
R14  43.35,4.55 180 top
R15  70.56,21.82 90 top  (outside the outline)
R16  26.57,21.39 0 top
RESET/BOOT  -0.76,-56.46 0 top  (outside the outline)
SCK  73.01,25.41 0 top  (outside the outline)
SDI  72.86,15.46 0 top  (outside the outline)
SDO  72.86,17.31 0 top  (outside the outline)
SW3  36.47,23.8 180 top
U1  8.3,33.68 270 top
U2  70.33,46.18 0 top  (outside the outline)
U3  14.85,36.44 0 top
U6  9.91,-34.54 0 top  (outside the outline)
U7  5.95,2.05 0 top
U8  26.2,21.69 180 top
U13  44.15,2.4 90 top
U14  43.86,33.68 270 top
U15  42.59,23.51 270 bottom
U16  14.66,17.17 90 top
U18  34.31,5.94 270 top
U25  40.93,54.37 270 top
U$2  21.08,8.92 180 top
U$5  [OUTLINE]  0,0 0 top
U$19  31.83,54.28 0 top
U$20  18.81,21.88 0 top
USB2  12.95,56.64 270 top
X2  30.89,28.44 270 top
X4  29.92,14.37 90 top

### Tracks (layer width: path | path; a pad name or v marks a point on that pad's centre or on a via)
5V  (via drill 0.38)  (24 unrouted)
  Top 0.254: U$2.27 15.21,9.79 C1.1 | C17.1 20.28,1.91 U$2.38 v20.28,6.55 20.27,4.72 | U18.1 32.96,6.93
32MCLR  (2 unrouted)
32PGC  (1 unrouted)
32PGD  (1 unrouted)
+3V3  (via drill 0.38)  (13 unrouted)
  Top 0.152: U8.COMM-A 27.25,22.89 27.51,22.63 v27.51,20.88
  Top 0.254: C15.1 20.35,37.61 U3.P$57 v20.34,34.9
  Top 0.305: U18.5 35.61,8.49 C7.+ 3.3V.TP
  Route2 0.254: v20.34,34.9 20.34,34.82
AVR_RESET  (via drill 0.38)  (3 unrouted)
  Top 0.152: U$2.4 25.75,7.32 v24.38,8.69
  Bottom 0.152: v24.38,8.69 24.38,8.99
AVRRX_PICTX  (2 unrouted)
AVRTX_PICRX  (1 unrouted)
B
  Top 0.152: R16.R2A 24.69,21.18 24.46,21.41 24,21.41 23.7,21.72 23.7,22.63 23.93,22.86 24.48,22.86 U8.BLUE
BLUE  (1 unrouted)
CON_ADC0  (via drill 0.38)
  Top 0.152: U$2.37 19.43,3.16 19.43,4.34 19.51,4.42 v19.51,5.64
  Bottom 0.152: U15.P9 37.87,12.44 37.87,8.46 36.73,7.32 35.36,7.32 32.23,4.19 20.12,4.19 19.51,4.8 v19.51,5.64
CON_ADC1  (via drill 0.38)
  Top 0.152: U$2.36 v18.67,4.8
  Bottom 0.152: U15.P10 38.18,10.21 38.18,7.32 37.87,7.01 35.51,7.01 32.38,3.89 19.05,3.89 18.67,4.27 v18.67,4.8
CON_ADC2  (via drill 0.38)
  Top 0.152: U$2.35 17.83,3.16 v17.83,5.71
  Route2 0.152: v17.83,5.71 17.83,6.17
  Bottom 0.152: U15.P11 38.48,7.97 38.48,7.01 38.18,6.71 35.66,6.71 32.54,3.58 18.75,3.58 17.83,4.5 v17.83,5.71
CON_ADC3  (via drill 0.38)
  Top 0.152: U$2.34 17.07,3.12 v17.07,4.8
  Bottom 0.152: U15.P12 35.85,6.37 32.69,3.2 18.67,3.2 v17.07,4.8
CON_ADC4
  Top 0.152: U$2.33 14.21,4.92 12.75,6.37 U16.P1
CON_ADC5
  Top 0.152: U$2.32 13.87,5.72 11.48,8.1 U16.P2
CON_ADC6
  Top 0.152: U16.P3 12.65,10.29 12.65,7.39 13.52,6.52 U$2.31
CON_ADC7
  Top 0.152: U$2.30 13.18,7.32 12.95,7.54 12.95,12.52 U16.P4
CON_INT0  (2 unrouted)
CON_INT1  (1 unrouted)
  Top 0.152: U$2.23 15.24,12.95 13.79,12.95 13.56,13.18 13.56,14.1 12.27,15.39 10.67,15.39 10.36,15.7 10.36,20.27 10.52,20.42 11.96,20.42 12.57,21.03 12.57,23.06 U16.P8
CON_INT2  (2 unrouted)
CON_INT3  (2 unrouted)
CON_IO0  (2 unrouted)
  Top 0.152: U$2.12 25.08,15.92 24.46,16.54 | U16.P5
CON_IO1  (1 unrouted)
  Top 0.152: U$2.24 13.41,12.12 13.26,12.27 13.26,13.87 12.04,15.09 10.52,15.09 10.06,15.54 10.06,20.42 11.25,21.61 U16.P7
CON_IO2  (1 unrouted)
  Top 0.152: U$2.22 13.4,14.72 12.88,15.24 12.88,24 12.65,24.23 12.65,24.69 11.48,25.86 U16.P9
CON_IO3  (2 unrouted)
CON_PWM0  (via drill 0.38)  (1 unrouted)
  Top 0.152: U$2.43 24.28,5.9 v24.23,5.94
  Bottom 0.152: v24.23,5.94 24.23,6.17
CON_PWM1  (via drill 0.38)
  Top 0.152: U$2.44 v25.07,6.78
  Bottom 0.152: U15.P8 39.41,15.56 37.57,13.72 37.57,8.69 36.5,7.62 35.2,7.62 32.08,4.5 25.53,4.5 25.07,4.95 v25.07,6.78
CON_PWM2  (1 unrouted)
CON_PWM3  (1 unrouted)
CON_SCK  (4 unrouted)
CON_SPI_CS  (3 unrouted)
CONFIG  (2 unrouted)
CTS  (via drill 0.38)  (1 unrouted)
  Top 0.254: U$2.26 v17.22,10.52
D+  (2 unrouted)
D-  (2 unrouted)
G
  Top 0.152: U8.GRN 25.03,21.99 25.45,21.57 25.45,20.84 R16.R3A
GND  (via drill 0.38, 0.9)  (83 unrouted)
  Top 0.152: U3.P$41 27.66,30.94 v28.12,30.94
  Top 0.254: U$2.28 15.2,8.84 14.48,8.84 13.77,8.13 C1.2 | C17.2 21.08,2.18 U$2.39 v21.08,5.59 21.03,5.64 | C11.2 C15.2 | C8.- 34.82,2.59 34.37,3.05 34.37,3.75 C9.2
  Bottom 0.152: v28.12,30.94 27.74,30.94
  other vias: 27.89,25.45 35.41,10.63 32.66,10.63
  pour Top (isolate 0.254): 69.01,26.71 72.31,26.71 72.31,24.21 69.01,24.21 69.01,25.71 68.91,25.81 68.21,25.81 68.21,26.11 68.61,26.11 68.81,26.31 69.01,26.31
  pour Top (isolate 0.254): 32.8,4.75 32.8,6.95 33.75,6.95 33.75,8.25 35.15,8.25 35.15,6.95 34.55,6.95 34.55,4.5 32.8,4.5
  pour Top (isolate 0.254): 14.75,29.7 14.75,26.85 15.95,26.85 15.95,29.7
  pour Top (isolate 0.254, rank 6): 27.36,8.92 27.36,12.88 26.75,13.49 26.75,15.39 26.06,16.08 26.06,17.91 26.67,18.52 33.45,18.52 34.37,17.6 34.37,14.4 32.46,12.5 32.46,8.31 31.93,7.77 27.36,7.77 27.2,7.92 27.2,8.69 27.36,8.84
  pour Bottom: 0,0 50.83,0 50.83,63.63 0,63.63 0,0.08
  pour Top (isolate 0.254): 26.97,31.93 26.97,24.77 27.74,24 32.54,24 33.38,24.84 33.38,29.64 31.93,31.09 31.09,31.93
GREEN  (1 unrouted)
LED1  (via drill 0.38)  (2 unrouted)
  Top 0.152: U$2.42 23.48,6.78 v23.39,6.86
  Bottom 0.152: v23.39,6.86 23.01,6.86
LED2  (via drill 0.38)  (2 unrouted)
  Top 0.152: U$2.41 22.68,5.9 v22.63,5.94
  Bottom 0.152: v22.63,5.94 22.4,5.94
MISO  (4 unrouted)
MOSI  (4 unrouted)
N$2
  Top 0.254: U18.3 33.01,4.71 33.3,4.42 33.3,3.81 R4.2
N$3  (1 unrouted)
N$4  (1 unrouted)
  Top 0.152: U3.P$40 27.32,30.44 28.8,28.96 31.07,28.96 X2.P$1
N$5
  Top 0.254: C10.+ 22.03,38.41 21.26,38.41 20.85,37.99 U3.P$56 20.85,38.82 20.49,39.17 C11.1
N$6  (1 unrouted)
  Top 0.152: U3.P$39 27.36,29.95 29.49,27.81 X2.P$3
N$7  (via drill 0.9)
  other vias: 52.92,21.31
N$8  (1 unrouted)
  Top 0.254: C5.1 28.61,15.81 28.96,15.47
  Top 0.305: U$2.8 28.5,10.52 28.8,10.21 30.25,10.21 30.71,10.67 30.71,12.72 30.1,13.34 29.49,13.34 29.03,13.79 29.03,14.55 X4.P$1
N$9  (1 unrouted)
  Top 0.254: C13.1 30.85,15.53 30.71,15.39
  Top 0.305: U$2.7 30.44,9.72 31.17,10.44 31.17,14.76 X4.P$3
N$10  (2 unrouted)
N$11  (via drill 0.9)
  other vias: 52.44,19.83
N$12  (1 unrouted)
N$14  (1 unrouted)
N$18  (via drill 0.9)
  other vias: 69.81,20.01
N$19  (2 unrouted)
N$20  (1 unrouted)
N$21  (1 unrouted)
N$22  (via drill 0.38)
  other vias: 17.22,12.04
N$24  (via drill 0.38)
  other vias: 14.25,19.58
N$25  (1 unrouted)
N$26  (1 unrouted)
N$28  (via drill 0.38)
  other vias: 15.85,19.58
N$29  (via drill 0.38)
  other vias: 17.45,19.58
N$30  (1 unrouted)
N$31  (via drill 0.38)
  other vias: 19.05,19.58
N$33  (1 unrouted)
N$35  (1 unrouted)
N$36  (1 unrouted)
NONSENSE  (4 unrouted)
R
  Top 0.152: U8.RED R16.R4A
RAIL1  (12 unrouted)
RAIL1SENSE  (4 unrouted)
RAIL2  (13 unrouted)
RAIL2SENSE  (4 unrouted)
RAWSENSE  (4 unrouted)
RED  (1 unrouted)
RESET  (1 unrouted)
RTS  (via drill 0.38)  (2 unrouted)
  Top 0.152: U$2.25 15.31,11.28 17.3,11.28
  other vias: 18.59,11.35
SW  (2 unrouted)
USBID  (2 unrouted)
VBUS  (1 unrouted)
VCC  (7 unrouted)
VCC_5.0  (3 unrouted)
VDD  (3 unrouted)

### Text on the board
tPlace: RAW | GND | TY | HY
bPlace: TX
tNames: Robert Breznak | Alex Camilo | Kevin Harrington | Greg Cole
bNames: REV: D | Model: NR001 | 74:F7:26
tValues: WASP Connector | Power 6.6 to 12v
200bmp: /home/acamilo/Downloads/logo_blurb.bmp